# Altium schematic sheet MCU.SchDoc
size A; SheetNumber: 2; SheetTotal: 12
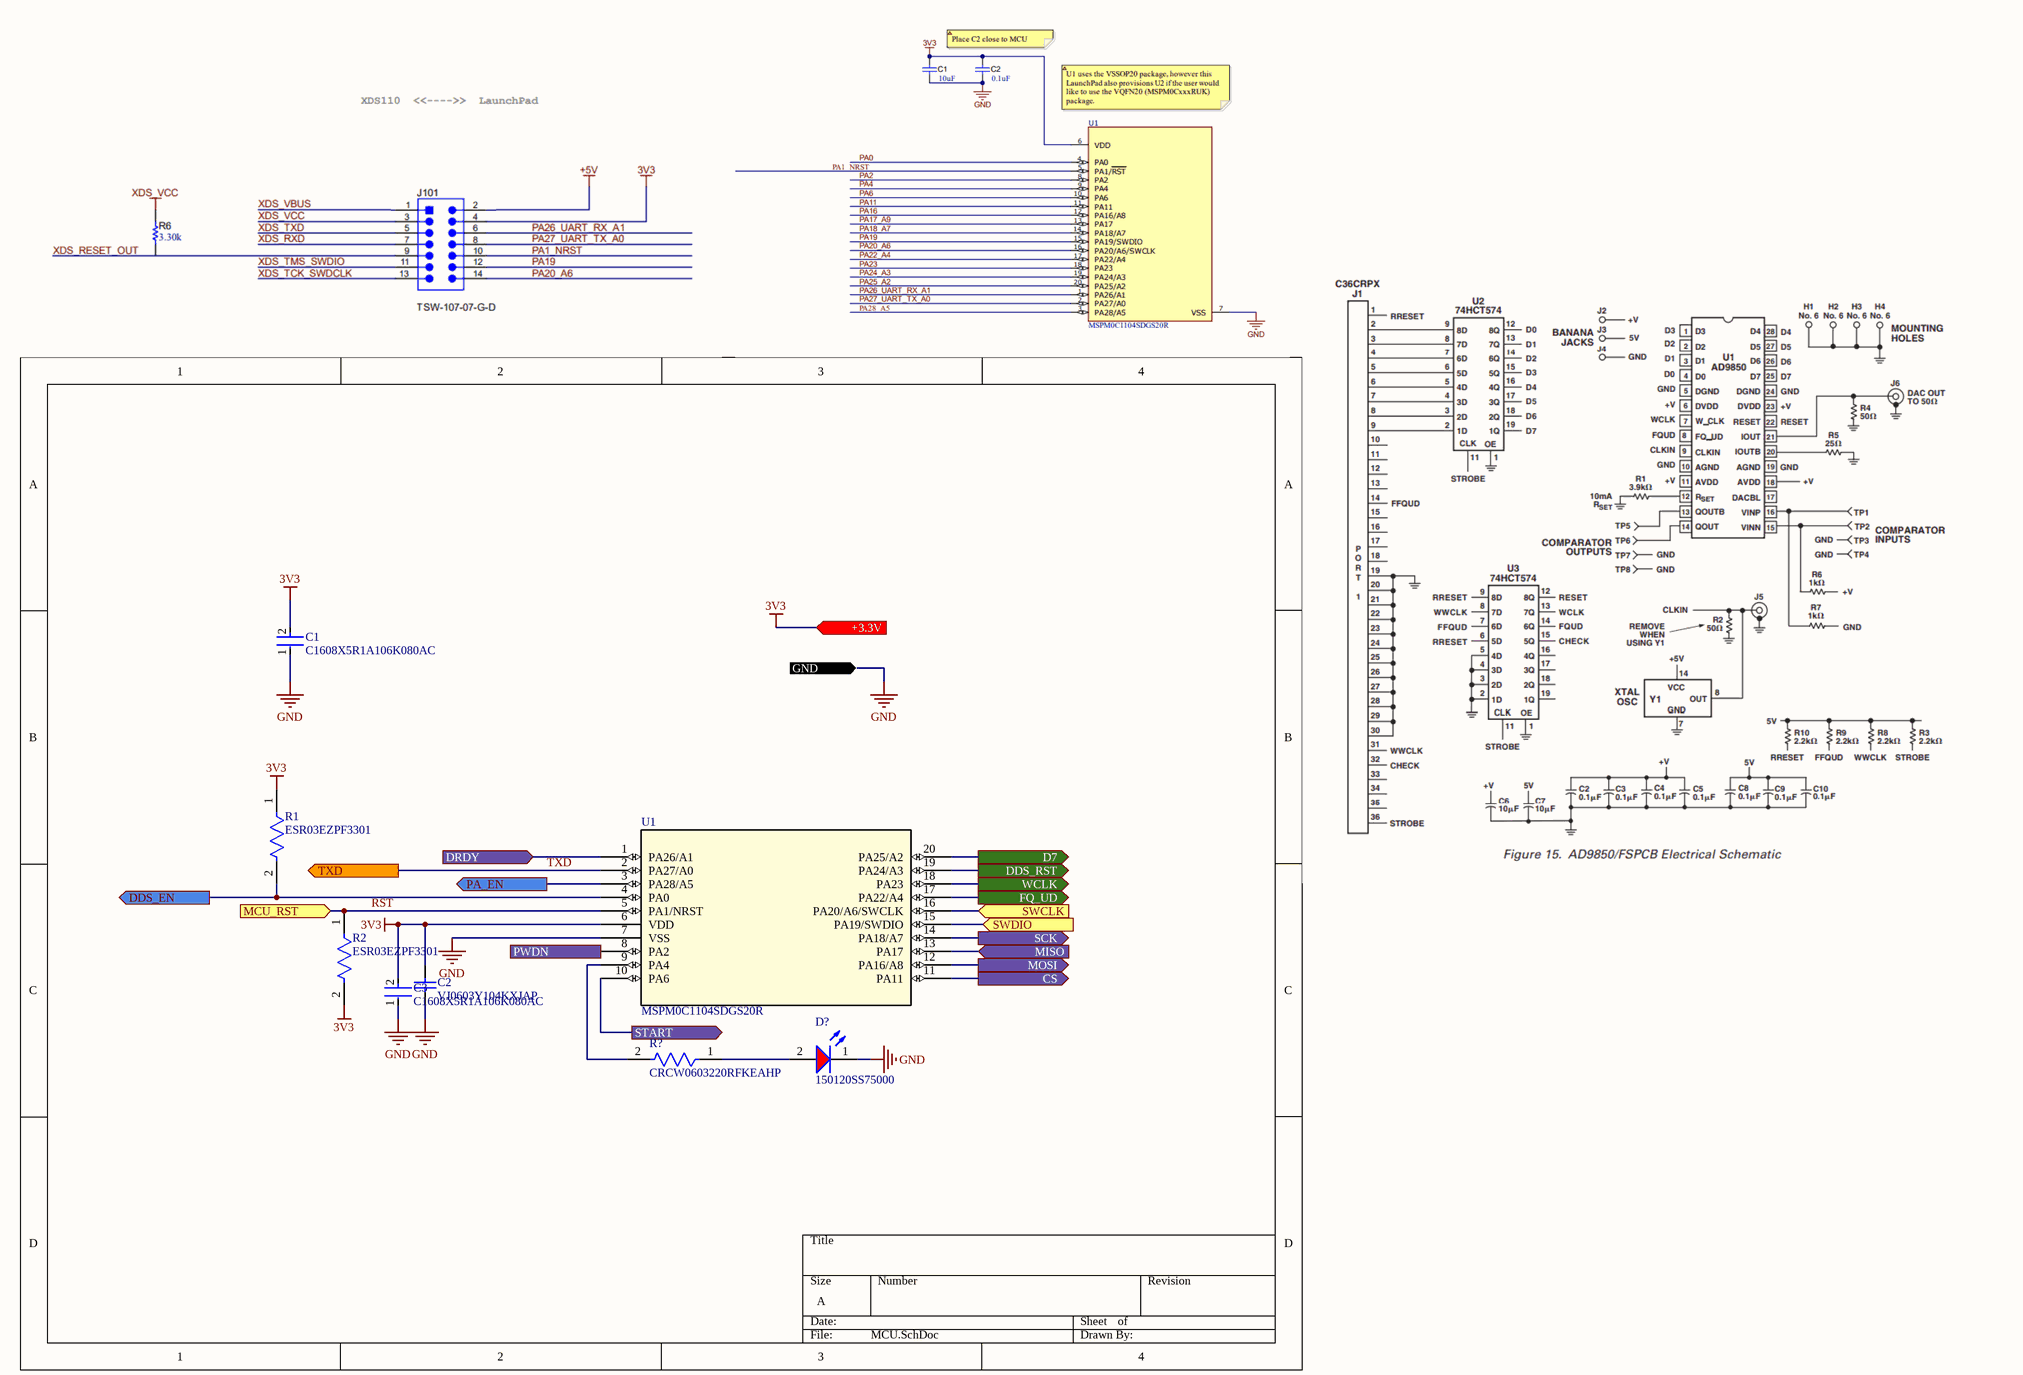
[diagram p0: MCU.SchDoc]

## Parts
C1  C1608X5R1A106K080AC  [FP-C1608-080-0_1-MFG]
C2  VJ0603Y104KXJAP  [CAPC1608X92X38NL15T08]
C3  C1608X5R1A106K080AC  [FP-C1608-080-0_1-MFG]
D?  150120SS75000  [WL-SMCW_1206_150120xx75000]
R1  ESR03EZPF3301  [FP-ESR03-IPC_A]
R2  ESR03EZPF3301  [FP-ESR03-IPC_A]
R?  CRCW0603220RFKEAHP  [FP-CRCW0603-HPe3-IPC_A]
U1  MSPM0C1104SDGS20R  [DGS0020A_TEX]

## Ports
+3.3V (in), CS (out), D7 (out), DDS_EN (out), DDS_RST (out), DRDY (in), FQ_UD (out), GND (in), MCU_RST (in), MISO (in), MOSI (out), PA_EN (out), PWDN (out), SCK (out), START (out), SWCLK (in), SWDIO (in), TXD (out), WCLK (out)

## Nets
3V3: C1.2 C2.2 C3.2 R1.1 R2.2 U1.6(VDD) ; port +3.3V
GND: C1.1 C2.1 C3.1 D?.1(K) U1.7(VSS) ; port GND
CS: U1.11(PA11) ; port CS
D7: U1.20(PA25/A2) ; port D7
DDS_EN: R1.2 U1.4(PA0) ; port DDS_EN
DDS_RST: U1.19(PA24/A3) ; port DDS_RST
DRDY: U1.1(PA26/A1) ; port DRDY
FQ_UD: U1.17(PA22/A4) ; port FQ_UD
MISO: U1.13(PA17) ; port MISO
MOSI: U1.12(PA16/A8) ; port MOSI
PA_EN: U1.3(PA28/A5) ; port PA_EN
PWDN: U1.8(PA2) ; port PWDN
RST: R2.1 U1.5(PA1/NRST) ; port MCU_RST
SCK: U1.14(PA18/A7) ; port SCK
START: U1.10(PA6) ; port START
SWCLK: U1.16(PA20/A6/SWCLK) ; port SWCLK
SWDIO: U1.15(PA19/SWDIO) ; port SWDIO
TXD: U1.2(PA27/A0) ; port TXD
WCLK: U1.18(PA23) ; port WCLK
NetD?_2: D?.2(A) R?.1
NetR?_2: R?.2 U1.9(PA4)

## Library data of the parts
C1 C3 = CMP-2000-04979-3: Multilayer Ceramic Capacitors 10μF ±10% 10V X5R SMD 0603; Capacitance: 10uF; Dielectric Material: Ceramic; Construction: Flat; Height: 0.8mm; Thickness: 0.035inch; Case Code (Metric): 1608; Radiation Hardening: No; Number of Pins: 2; Voltage Rating (DC): 10V; Depth: 0.8mm; Voltage: 10V; RoHS Compliant: Yes; Voltage Rating: 10V; Package Quantity: 1; Resistor Type: Ceramic; Termination: SMD/SMT; Lead Free: Lead Free; REACH SVHC: No SVHC; Tolerance: 10%; Mount: Surface Mount; Series: C; Packaging: Tape and Reel; Width: 0.8mm; Dielectric: X5R; Weight: 7.1E-05oz; Length: 1.6mm; Max Operating Temperature: 85°C; Case Code (Imperial): 0603; Case/Package: 0603; Min Operating Temperature: -55°C
C2 = CMP-2006-01211-1: Manufacturer: Vitramon; Part Number: VJ0603Y104KXJAP
D? = CMP-1426-00017-3: Led, Red, 630 Nm, 1.9 V, 30 Ma, 60 Mcd Rohs Compliant: Yes; Forward Current: 100mA; Max Reverse Voltage (DC): 5V; Lens Style: Clear, Rectangular; Viewing Angle: 140°; Luminous Intensity: 60mcd; Peak Wavelength: 645nm; Forward Voltage: 1.9V; Test Current: 20mA; Dominant Wavelength: 630nm; Case Code (Imperial): 1206; Length: 3.2mm; Mount: Surface Mount; Case Code (Metric): 3216; Case/Package: 1206; Min Operating Temperature: -40°C; Width: 1.6mm; Color: Red; Height: 680µm; REACH SVHC: Unknown; Max Operating Temperature: 85°C; Wavelength: 630nm; RoHS: Compliant; Packaging: Tape and Reel
R1 R2 = CMP-08839-028747-1: 3.3kΩ ±1% 0.25W 0603 Anti-Surge Chip Resistor AEC-Q200; Temperature Coefficient: 100ppm/°C; Resistance: 3.3kR; Max Power Dissipation: 250mW; Tolerance: 1%; Min Operating Temperature: -55°C; Features: Automotive AEC-Q200; Max Operating Temperature: 155°C; Number of Terminations: 2; Series: ESR; Packaging: Tape and Reel; Resistor Type: Thick Film; RoHS Compliant: Yes; Case/Package: 0603
R? = CMP-02407-003593-1: RES Thick Film, 220Ω, 1%, 0.33W, 100ppm/°C, 0603; Max Power Dissipation: 250mW; Voltage Rating (DC): 75V; Resistance: 220R; Radiation Hardening: No; Contact Plating: Tin; Length: 1.6mm; Depth: 0.85mm; Composition: Thick Film; Lead Free: Lead Free; Mount: Surface Mount; Package Quantity: 5000; Height: 0.45mm; Termination: SMD/SMT; Weight: 7.1E-05oz; Military Standard: Not; Number of Terminations: 2; Case Code (Metric): 1608; Max Operating Temperature: 155°C; Power Rating: 250mW; Tolerance: 1%; Temperature Coefficient: 100ppm/°C; Features: Automotive AEC-Q200; Case Code (Imperial): 0603; Width: 0.033inch; Min Operating Temperature: -55°C; Case/Package: 0603; Voltage Rating: 75V; Packaging: Tape and Reel
U1 = MSPM0C1104SDGS20R: 24MHz ArmÂ® CortexÂ®-M0+ MCU with 16KB flash, 1KB SRAM, 12-bit ADC 20-VSSOP -40 to 125; Manufacturer_Name: Texas Instruments; Copyright: Copyright (C) 2025 Ultra Librarian. All rights reserved.; Manufacturer_Part_Number: MSPM0C1104SDGS20R; Datasheet: https://www.ti.com/lit/gpn/mspm0c1104; RefDes: RefDes; Type: Type